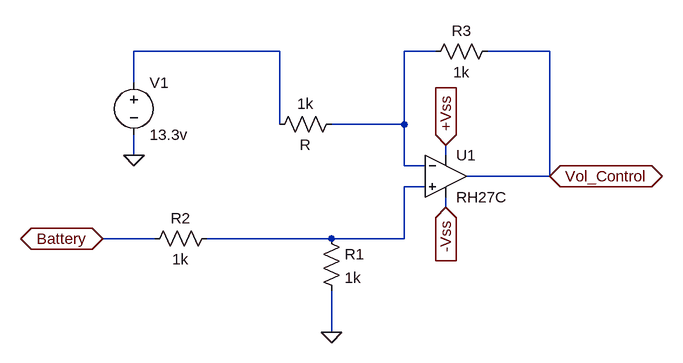
[diagram p0: schematic Contant_voltage.asc]
Contant_voltage.asc, the LTspice schematic file:
Version 4
SHEET 1 880 680
WIRE 208 32 -16 32
WIRE 448 32 400 32
WIRE 624 32 528 32
WIRE -16 80 -16 32
WIRE 208 144 208 32
WIRE 400 144 400 32
WIRE 400 144 288 144
WIRE -16 192 -16 160
WIRE 464 192 464 176
WIRE 400 208 400 144
WIRE 432 208 400 208
WIRE 624 224 624 32
WIRE 624 224 496 224
WIRE 432 240 400 240
WIRE 464 272 464 256
WIRE 16 320 -64 320
WIRE 288 320 96 320
WIRE 400 320 400 240
WIRE 400 320 288 320
WIRE 288 464 288 400
FLAG -16 192 0
FLAG 288 464 0
FLAG 624 224 Vol_Control
IOPIN 624 224 BiDir
FLAG 464 272 -Vss
IOPIN 464 272 In
FLAG 464 176 +Vss
IOPIN 464 176 In
FLAG -64 320 Battery
IOPIN -64 320 BiDir
SYMBOL voltage -16 64 R0
WINDOW 123 0 0 Left 0
WINDOW 39 0 0 Left 0
SYMATTR InstName V1
SYMATTR Value 13.3v
SYMBOL res 304 128 R90
WINDOW 0 0 56 VBottom 2
WINDOW 3 32 56 VTop 2
SYMATTR InstName 1k
SYMBOL res 112 304 R90
WINDOW 0 0 56 VBottom 2
WINDOW 3 32 56 VTop 2
SYMATTR InstName R2
SYMATTR Value 1k
SYMBOL res 272 304 R0
SYMATTR InstName R1
SYMATTR Value 1k
SYMBOL OpAmps\\RH27C 464 160 R0
SYMATTR InstName U1
SYMBOL res 544 16 R90
WINDOW 0 0 56 VBottom 2
WINDOW 3 32 56 VTop 2
SYMATTR InstName R3
SYMATTR Value 1k

The netlist it stands for:
* Contant_voltage.asc
V1 N001 0 13.3v
R§1k N002 N001 R
R2 N003 Battery 1k
R1 N003 0 1k
XU1 N003 N002 +Vss -Vss Vol_Control RH27C  ; pins In+ In- V+ V- OUT
R3 Vol_Control N002 1k
.backanno
.end